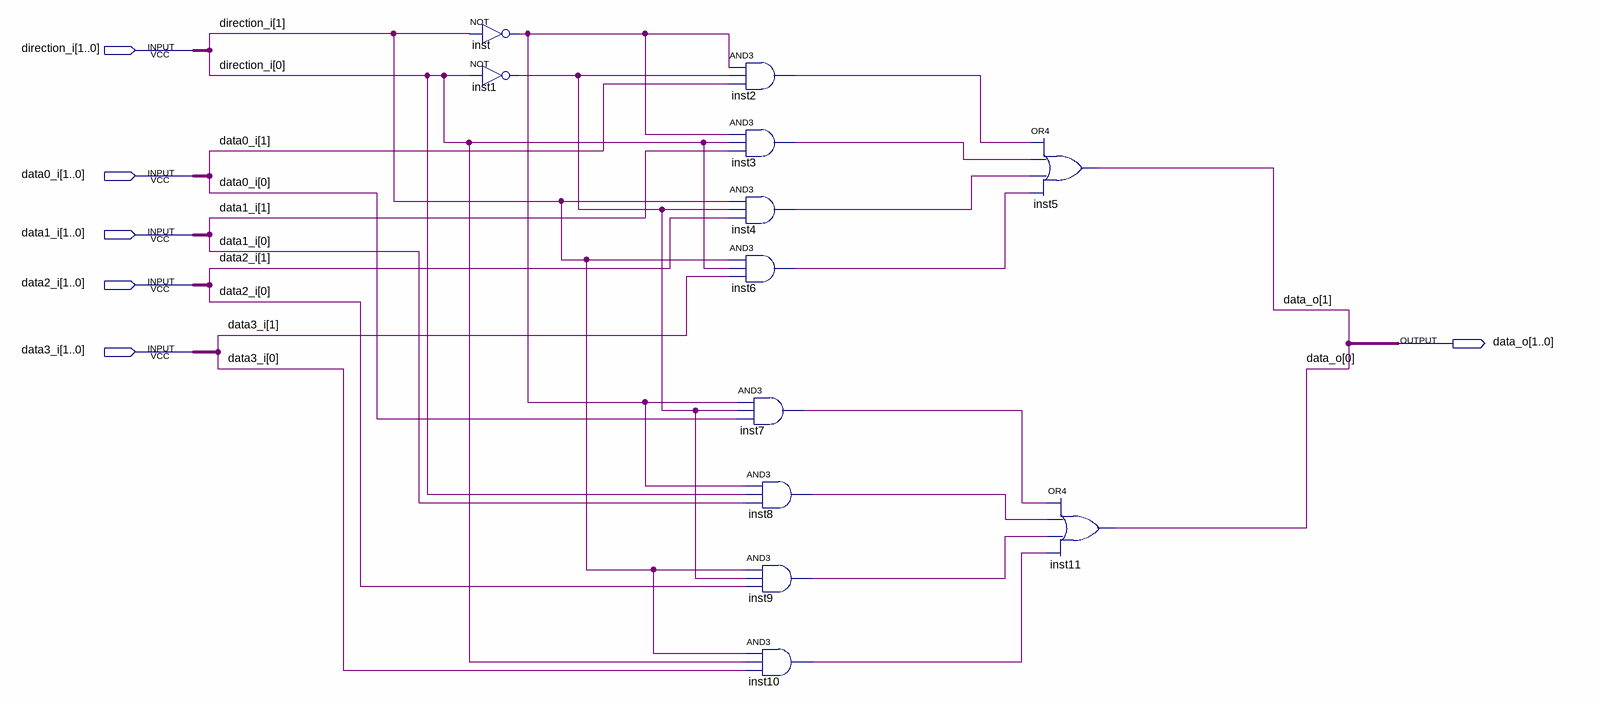
[diagram p0: schematic sheet]
// Quartus schematic mux4_1.bdf as structural Verilog: 12 symbols, 6 pins
module mux4_1 (
  input  [1:0] direction_i,
  input  [1:0] data0_i,
  input  [1:0] data1_i,
  input  [1:0] data2_i,
  input  [1:0] data3_i,
  output [1:0] data_o
);

  wire inst1_out, inst2_out, inst3_out, inst4_out, inst6_out, inst7_out, inst8_out, inst9_out, inst10_out,
       inst_out;

  not inst (inst_out, direction_i[1]);
  not inst1 (inst1_out, direction_i[0]);
  and inst2 (inst2_out, inst_out, inst1_out, data0_i[1]);
  and inst3 (inst3_out, inst_out, direction_i[0], data1_i[1]);
  and inst4 (inst4_out, direction_i[1], inst1_out, data2_i[1]);
  and inst6 (inst6_out, direction_i[1], direction_i[0], data3_i[1]);
  and inst7 (inst7_out, inst_out, inst1_out, data0_i[0]);
  and inst8 (inst8_out, inst_out, direction_i[0], data1_i[0]);
  and inst9 (inst9_out, direction_i[1], inst1_out, data2_i[0]);
  and inst10 (inst10_out, direction_i[1], direction_i[0], data3_i[0]);
  or inst5 (data_o[1], inst2_out, inst3_out, inst4_out, inst6_out);
  or inst11 (data_o[0], inst7_out, inst8_out, inst9_out, inst10_out);
endmodule
